# EAGLE design extruder_breakout (EAGLE 6.5.0)
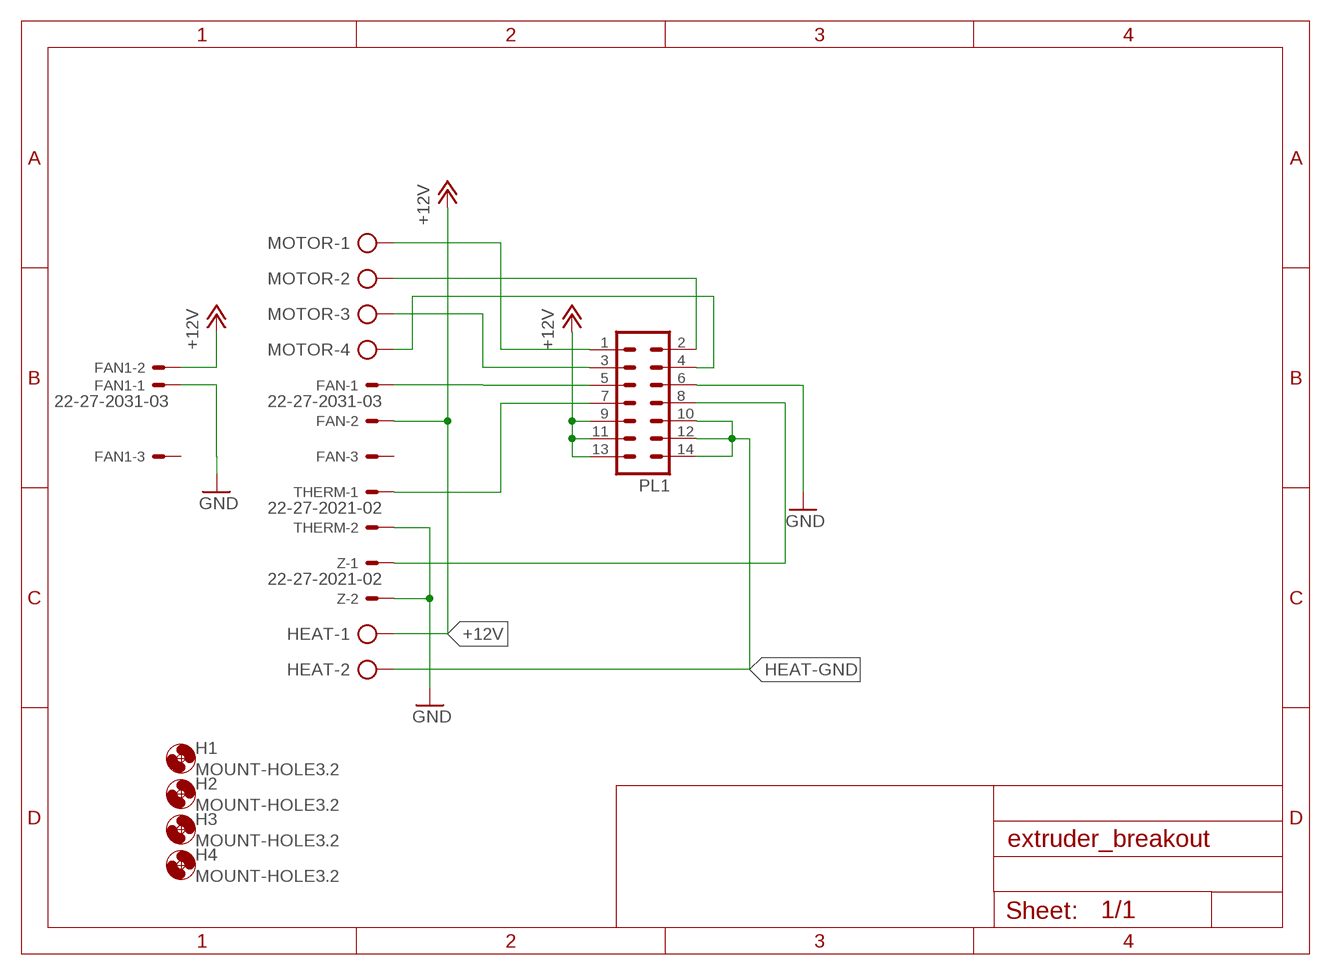
[diagram p0: schematic, sheet 1]

## Parts
FAN  22-27-2031-03  [6410-03]
FAN1  22-27-2031-03  [6410-03]
H1  MOUNT-HOLE3.2  [3,2]
H2  MOUNT-HOLE3.2  [3,2]
H3  MOUNT-HOLE3.2  [3,2]
H4  MOUNT-HOLE3.2  [3,2]
HEAT  AK500/2  [AK500/2]
MOTOR  AK500/4  [AK500/4]
PL1  14V  [14V]
THERM  22-27-2021-02  [6410-02]
Z  22-27-2021-02  [6410-02]

## Nets
+12V: FAN1.2 FAN.2 HEAT.1 PL1.9 PL1.11 PL1.13
GND: FAN1.1 PL1.6 THERM.2 Z.2
HEAT-GND: HEAT.2 PL1.10 PL1.12 PL1.14
N$1: MOTOR.1 PL1.1
N$2: MOTOR.2 PL1.2
N$3: MOTOR.3 PL1.3
N$4: MOTOR.4 PL1.4
N$5: FAN.1 PL1.5
N$6: PL1.7 THERM.1
N$7: PL1.8 Z.1
Unconnected: FAN1.3 FAN.3

## Library data of the parts
FAN FAN1 = con-molex:22-?-03: CONNECTOR wire to board 2.54 mm (.1 inch) pitch header; OC_FARNELL: unknown; OC_NEWARK: unknown
H1-H4 = holes:MOUNT-HOLE: MOUNTING HOLE with drill center marker
HEAT = con-ptr500:AK500/2: CONNECTOR; OC_FARNELL: unknown; OC_NEWARK: unknown
MOTOR = con-ptr500:AK500/4: CONNECTOR; OC_FARNELL: unknown; OC_NEWARK: unknown
PL1 = con-harting-v:14V: CONNECTOR; OC_FARNELL: unknown; OC_NEWARK: unknown
THERM Z = con-molex:22-?-02: CONNECTOR wire to board 2.54 mm (.1 inch) pitch header; OC_FARNELL: unknown; OC_NEWARK: unknown

## Board
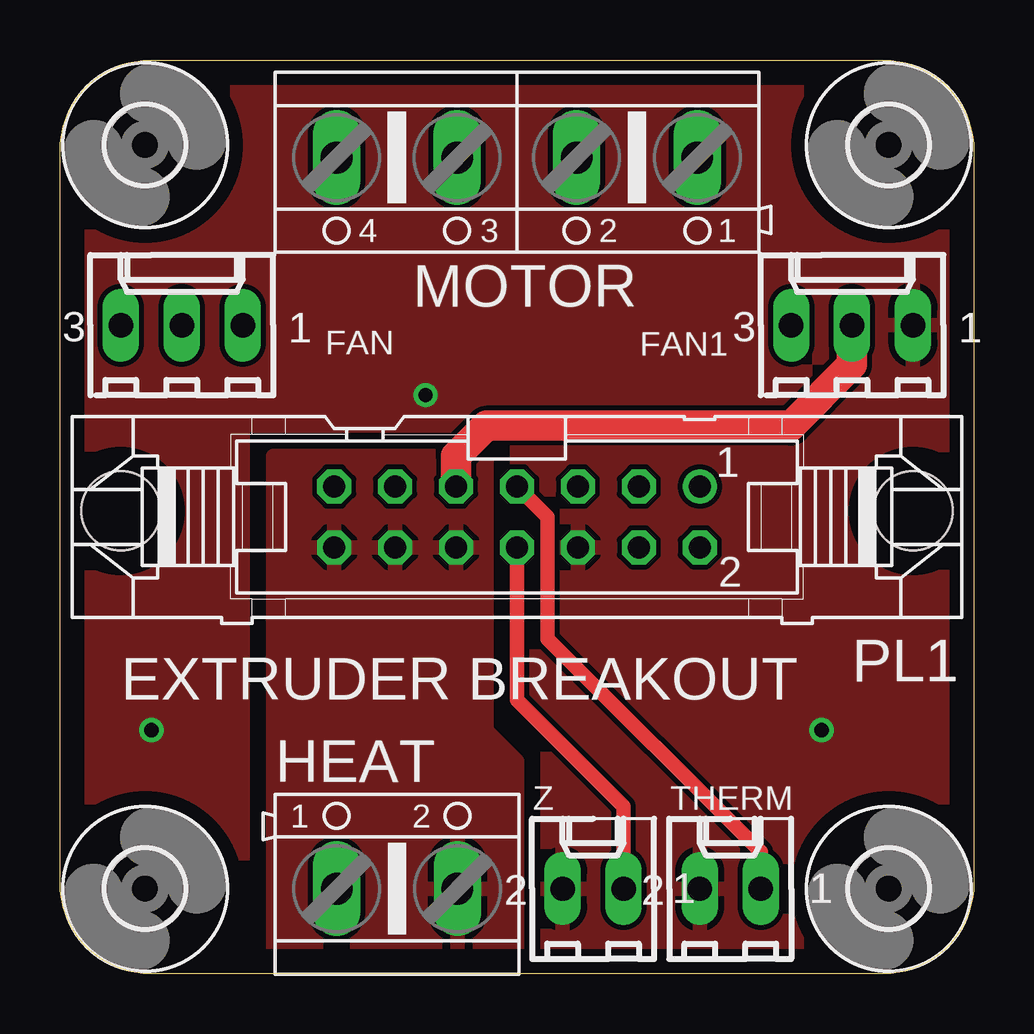
[diagram p1: board, top side]
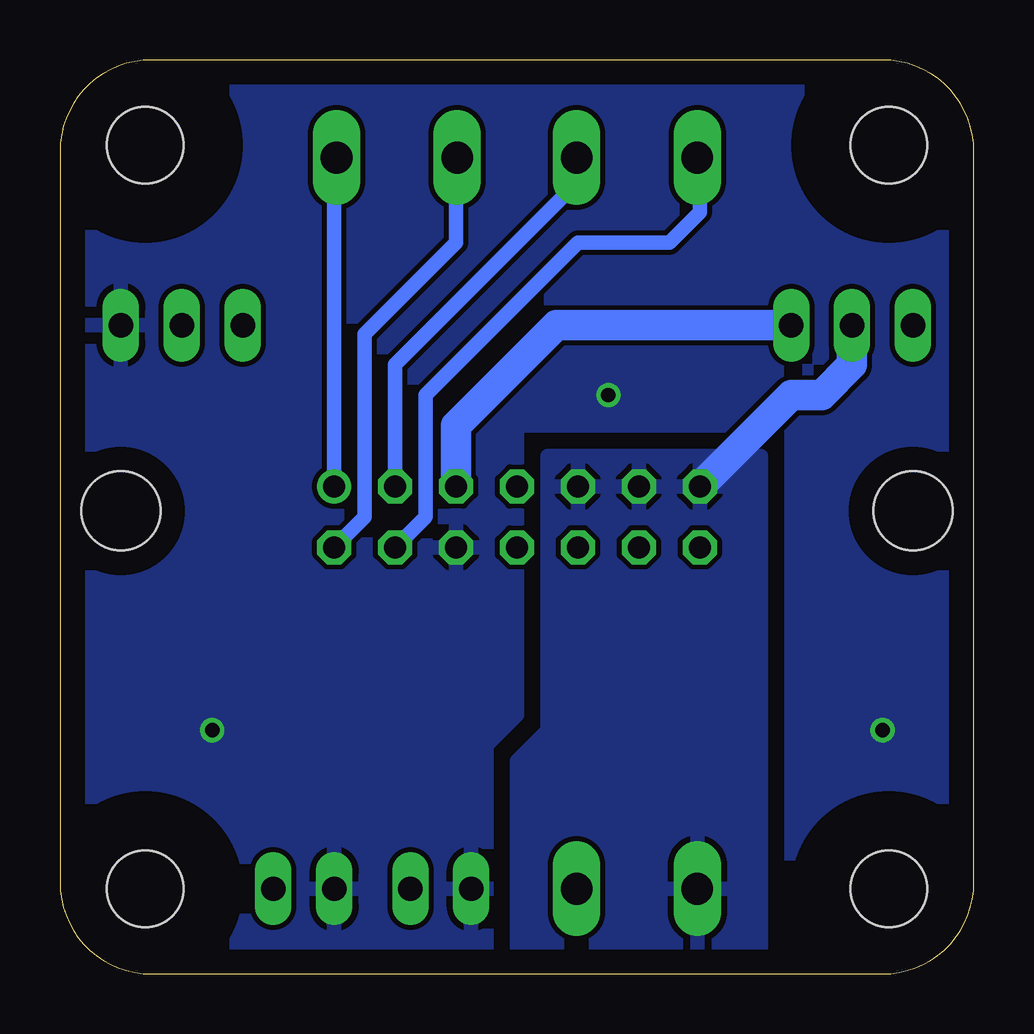
[diagram p2: board, bottom side, seen from below]

Size 38.1 x 38.1 mm. Coordinates in mm from the lower left corner, seen from the top.
Outline: 0,34.29 arc-90 3.81,38.1 34.29,38.1 arc-90 38.1,34.29 38.1,3.81 arc-90 34.29,0 3.81,0 arc-90 0,3.81 0,34.29
Copper layers (1*16): Top 0.035mm / dielectric 1.5mm / Bottom 0.035mm
Design rules "default": minimum track width 10mil, minimum drill 24mil, track to track 8mil, track to pad 8mil, pad to pad 8mil, via to via 8mil, smd to smd 8mil, copper to edge 40mil, drill to drill 8mil, minimum pad ring 10mil, minimum via ring 8mil, stop-mask expansion 4mil, vias tented up to drill 0mil, thermal gap 10mil

### Footprints (pad centres in the part's own frame; a part is rotated, then mirrored left to right if it is on the bottom)
6410-03 = drill 1.016 long: 1 2.54,0; 2 0,0; 3 -2.54,0
3,2 = hole 3.2: 0,0
AK500/2 = drill 1.321 long: 1 -2.515,0; 2 2.515,0
AK500/4 = drill 1.321 long: 1 -7.518,0; 2 -2.489,0; 3 2.489,0; 4 7.518,0
14V = drill 0.914: 1 -7.62,-1.27 | drill 0.914 octagon: 2 -7.62,1.27; 3 -5.08,-1.27; 4 -5.08,1.27; 5 -2.54,-1.27; 6 -2.54,1.27; 7 0,-1.27; 8 0,1.27; 9 2.54,-1.27; 10 2.54,1.27; 11 5.08,-1.27; 12 5.08,1.27; 13 7.62,-1.27; 14 7.62,1.27 | hole 3.302: 16.51,-0.254; -16.51,-0.254
6410-02 = drill 1.016 long: 1 1.27,0; 2 -1.27,0

### Placement (x,y rotation side)
FAN  5.08,27.05 0 top
FAN1  33.02,27.05 0 top
H1  34.55,34.55 0 top
H2  3.55,34.55 0 top
H3  34.55,3.55 0 top
H4  3.55,3.55 0 top
HEAT  14.05,3.55 0 top
MOTOR  19.05,34.03 180 top
PL1  19.05,19.05 180 top
THERM  27.94,3.55 0 top
Z  22.23,3.55 0 top

### Tracks (layer width: path | path; a pad name or v marks a point on that pad's centre or on a via)
+12V
  Top 1.27: FAN1.2 33.02,25.4 30.48,22.86 17.78,22.86 16.51,21.59 PL1.9
  Bottom 1.27: PL1.13 7.62,24.13 6.35,24.13 5.08,25.4 FAN.2
  pour Bottom: 19.05,0 8.89,0 8.89,21.59 17.78,21.59 17.78,10.16 19.05,8.89
GND  (via drill 0.6)
  other vias: 31.75,10.16 3.81,10.16 15.24,24.13
  pour Bottom: 7.62,0 7.62,22.86 19.05,22.86 19.05,10.79 20.32,9.53 20.32,0 38.1,0 38.1,38.1 0,38.1 0,0
  pour Top: 7.62,0 7.62,22.86 19.05,22.86 19.05,10.79 20.32,9.53 20.32,0 38.1,0 38.1,38.1 0,38.1 0,0
HEAT-GND
  pour Top: 8.89,21.59 17.78,21.59 17.78,10.16 19.05,8.89 19.05,0 8.89,0
N$1
  Bottom 0.61: PL1.1 26.67,33.93 MOTOR.1
N$2
  Bottom 0.61: PL1.2 25.4,19.05 25.4,26.67 21.59,30.48 21.59,33.98 MOTOR.2
N$3
  Bottom 0.61: PL1.3 24.13,25.4 16.51,33.02 16.51,33.98 MOTOR.3
N$4
  Bottom 0.61: PL1.4 22.86,19.05 22.86,24.13 16.51,30.48 12.7,30.48 11.43,31.75 11.43,33.93 MOTOR.4
N$5
  Bottom 1.27: PL1.5 21.59,22.86 17.41,27.05 FAN.1
N$6
  Top 0.61: PL1.7 20.32,19.05 20.32,13.97 29.21,5.08 THERM.1
N$7
  Top 0.61: PL1.8 19.05,11.43 22.86,7.62 23.5,6.99 Z.1

### Text on the board
tNames: EXTRUDER BREAKOUT